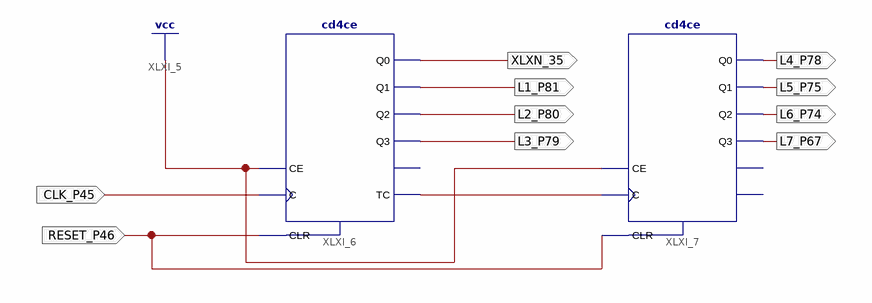
[diagram p0: schematic sheet 1]
// Xilinx ISE schematic Countertest.sch (spartan6) as structural Verilog: 2 symbols, 10 ports
module Countertest (
  input  CLK_P45,
  input  RESET_P46,
  output L1_P81,
  output L2_P80,
  output L4_P78,
  output L5_P75,
  output L6_P74,
  output L7_P67,
  output L3_P79,
  output XLXN_35
);

  wire L0_P82;

  cd4ce XLXI_7 (
    .C(L0_P82), .CE(1'b1), .CLR(RESET_P46), .Q0(L4_P78), .Q1(L5_P75), .Q2(L6_P74), .Q3(L7_P67));  // open: CEO, TC
  cd4ce XLXI_6 (
    .C(CLK_P45), .CE(1'b1), .CLR(RESET_P46), .Q0(XLXN_35), .Q1(L1_P81), .Q2(L2_P80), .Q3(L3_P79), .TC(L0_P82));  // open: CEO

  // Notes on the sheet:
  //   CLOCK_DEDICATED_ROUTE on signal CLK_P45 = TRUE
endmodule
